# EAGLE schematic rcsdcard_v1 (EAGLE 9.6.2)
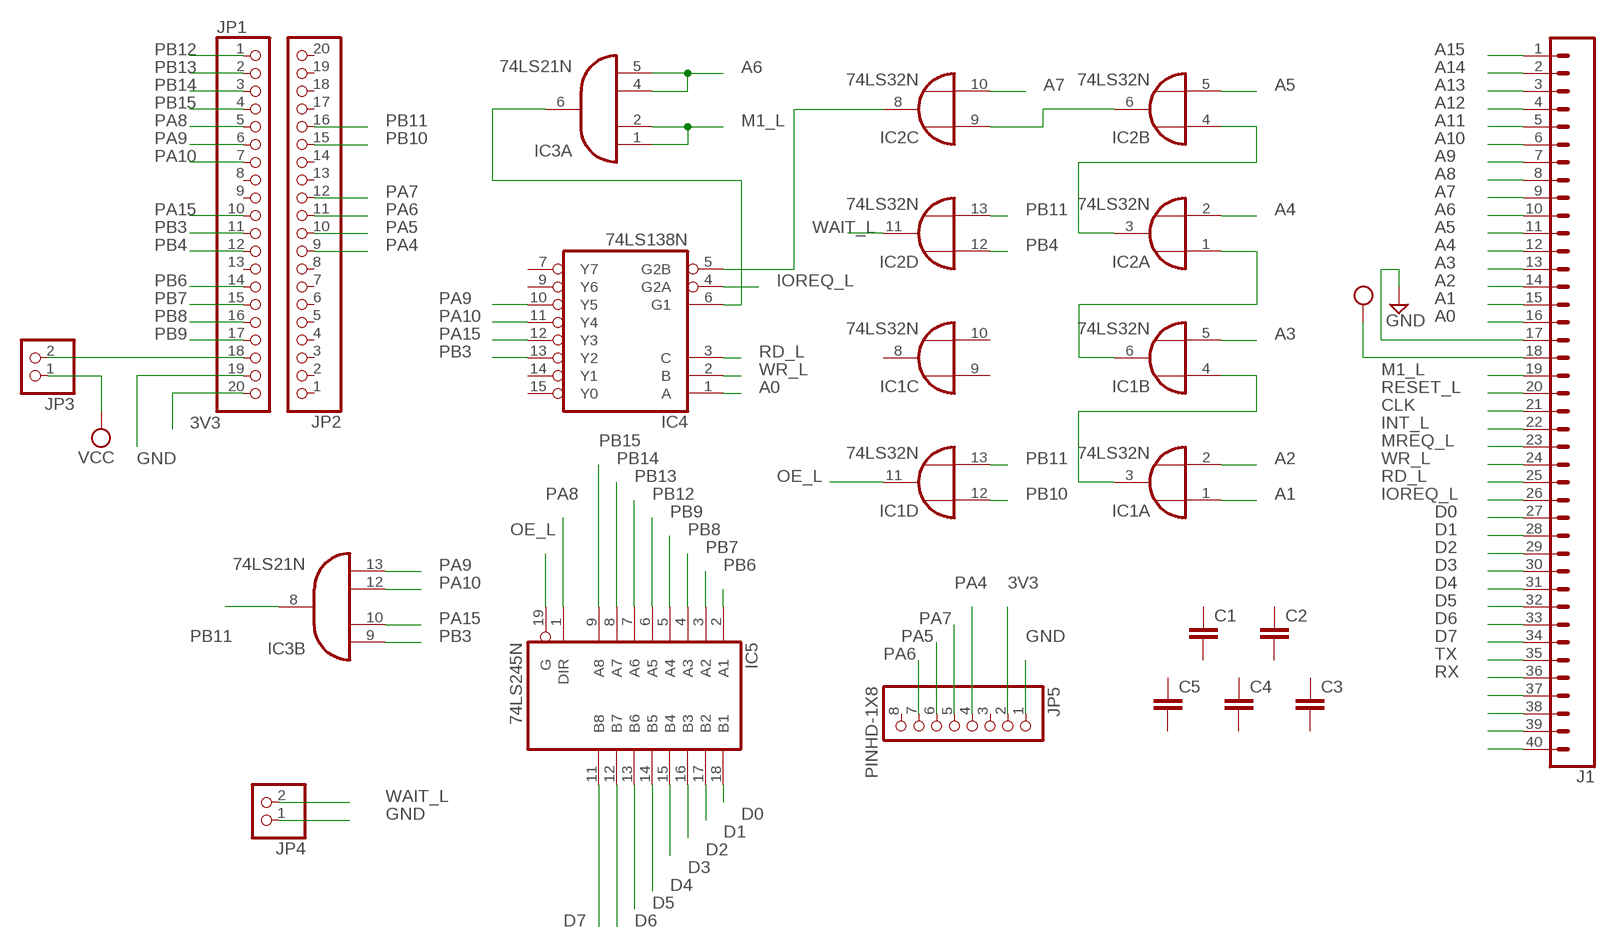
[diagram p0: schematic, sheet 1]

## Parts
C1  C-EU050-025X075  [C050-025X075]
C2  C-EU050-025X075  [C050-025X075]
C3  C-EU050-025X075  [C050-025X075]
C4  C-EU050-025X075  [C050-025X075]
C5  C-EU050-025X075  [C050-025X075]
IC1  74LS32N  [DIL14]
IC2  74LS32N  [DIL14]
IC3  74LS21N  [DIL14]
IC4  74LS138N  [DIL16]
IC5  74LS245N  [DIL20]
J1  CONN_40OFFSET  [1X40_OFFSET]
JP1  PINHD-1X20  [1X20]
JP2  PINHD-1X20  [1X20]
JP3  PINHD-1X2  [1X02]
JP4  PINHD-1X2  [1X02]
JP5  PINHD-1X8  [1X08]

## Nets
3V3: JP1.20 JP5.2
A0: IC4.1(A) J1.16
A1: IC1.1(A:I0) J1.15
A2: IC1.2(A:I1) J1.14
A3: IC1.5(B:I1) J1.13
A4: IC2.2(A:I1) J1.12
A5: IC1.6(B:O) IC2.1(A:I0) IC2.5(B:I1) J1.11
A6: IC3.4(A:I2) IC3.5(A:I3) J1.10
A7: IC2.10(C:I1) J1.9
A8: J1.8
A9: J1.7
A10: J1.6
A11: J1.5
A12: J1.4
A13: J1.3
A14: J1.2
A15: J1.1
CLK: J1.21
D0: IC5.18(B1) J1.27
D1: IC5.17(B2) J1.28
D2: IC5.16(B3) J1.29
D3: IC5.15(B4) J1.30
D4: IC5.14(B5) J1.31
D5: IC5.13(B6) J1.32
D6: IC5.12(B7) J1.33
D7: IC5.11(B8) J1.34
GND: J1.17 JP1.19 JP4.1 JP5.1
INT_L: J1.22
IOREQ_L: IC4.4(G2A) J1.26
M1_L: IC3.1(A:I0) IC3.2(A:I1) J1.19
MREQ_L: J1.23
N$1: J1.37
N$2: J1.38
N$3: J1.39
N$4: IC1.3(A:O) IC1.4(B:I0)
N$5: JP1.18 JP3.2
N$8: IC2.3(A:O) IC2.4(B:I0)
N$9: IC3.6(A:O) IC4.6(G1)
N$10: IC2.6(B:O) IC2.9(C:I0)
N$12: IC2.8(C:O) IC4.5(G2B)
N$13: J1.40
OE_L: IC1.11(D:O) IC5.19(G)
PA4: JP2.9 JP5.4
PA5: JP2.10 JP5.6
PA6: JP2.11 JP5.7
PA7: JP2.12 JP5.5
PA8: IC5.1(DIR) JP1.5
PA9: IC3.13(B:I3) IC4.10(Y5) JP1.6
PA10: IC3.12(B:I2) IC4.11(Y4) JP1.7
PA15: IC3.10(B:I1) IC4.12(Y3) JP1.10
PB3: IC3.9(B:I0) IC4.13(Y2) JP1.11
PB4: IC2.12(D:I0) JP1.12
PB6: IC5.2(A1) JP1.14
PB7: IC5.3(A2) JP1.15
PB8: IC5.4(A3) JP1.16
PB9: IC5.5(A4) JP1.17
PB10: IC1.12(D:I0) JP2.15
PB11: IC1.13(D:I1) IC2.13(D:I1) IC3.8(B:O) JP2.16
PB12: IC5.6(A5) JP1.1
PB13: IC5.7(A6) JP1.2
PB14: IC5.8(A7) JP1.3
PB15: IC5.9(A8) JP1.4
RD_L: IC4.3(C) J1.25
RESET_L: J1.20
RX: J1.36
TX: J1.35
VCC: J1.18 JP3.1
WAIT_L: IC2.11(D:O) JP4.2
WR_L: IC4.2(B) J1.24
Unconnected: C1.1 C1.2 C2.1 C2.2 C3.1 C3.2 C4.1 C4.2 C5.1 C5.2 IC1.8(C:O) IC1.9(C:I0) IC1.10(C:I1) IC4.7(Y7) IC4.9(Y6) IC4.14(Y1) IC4.15(Y0) JP1.8 JP1.9 JP1.13 JP2.1 JP2.2 JP2.3 JP2.4 JP2.5 JP2.6 JP2.7 JP2.8 JP2.13 JP2.14 JP2.17 JP2.18 JP2.19 JP2.20 JP5.3 JP5.8

## Power pins joined to a net without a drawn wire
GND: IC1.7(P:GND) IC2.7(P:GND) IC3.7(P:GND) IC4.8(GND) IC5.10(GND)
VCC: IC1.14(P:VCC) IC2.14(P:VCC) IC3.14(P:VCC) IC4.16(VCC) IC5.20(VCC)

## Library data of the parts
C1-C5 = rcl:C-EU: CAPACITOR, European symbol; SPICEPREFIX: C
IC1 IC2 = 74xx-eu:74*32: Quad 2-input OR gate
IC3 = 74xx-eu:74*21: Dual 4-input AND gate
IC4 = 74xx-eu:74*138: 3-line to 8-line DECODER/DEMULTIPLEXER
IC5 = 74xx-eu:74*245: Octal BUS TRANSCEIVER, 3-state
J1 = SparkFun-Connectors:CONN_40: Multi connection point. Often used as Generic Header-pin footprint for 0.1 inch spaced/style header connections On any of the 0.1 inch spaced packages, you can populate with these: Break Away Headers - Straight <https://www.sparkfun.com/products/116> (PRT-00116) Break Away Male Headers - Right Angle <https://www.sparkfun.com/products/553> (PRT-00553) Female Headers <https://www.sparkfun.com/products/115> (PRT-00115) Break Away Headers - Machine Pin <https://www.sparkfun.com/products/117> (PRT-00117) Break Away Female Headers - Swiss Machine Pin <https://www.sparkfun.com/products/743> (PRT-00743) For SCREWTERMINALS and SPRING TERMINALS visit here: Screw Terimnals on SparkFun.com <https://www.sparkfun.com/search/results?term=Screw+Terminals> (5mm/3.5mm/2.54mm spacing) This device is also useful as a general connection point to wire up your design to another part of your project. Our various solder wires solder well into these plated through hole pads. Hook-Up Wire - Assortment (Stranded, 22 AWG) <https://www.sparkfun.com/products/11375> (PRT-11375) Hook-Up Wire - Assortment (Solid Core, 22 AWG) <https://www.sparkfun.com/products/11367> (PRT-11367) View the entire wire category on our website here <https://www.sparkfun.com/categories/141> Special notes: Molex polarized connector foot print use with SKU : PRT-08231 with associated crimp pins and housings. 1MM SMD Version SKU: PRT-10208 NOTES ON THE VARIANTS LOCK and LOCK_LONGPADS... This footprint was designed to help hold the alignment of a through-hole component (i.e. 6-pin header) while soldering it into place. You may notice that each hole has been shifted either up or down by 0.005 of an inch from it's more standard position (which is a perfectly straight line). This slight alteration caused the pins (the squares in the middle) to touch the edges of the holes. Because they are alternating, it causes a "brace" to hold the component in place. 0.005 has proven to be the perfect amount of "off-center" position when using our standard breakaway headers. Although looks a little odd when you look at the bare footprint, once you have a header in there, the alteration is very hard to notice. Also,if you push a header all the way into place, it is covered up entirely on the bottom side.
JP1 JP2 = pinhead:PINHD-1X20: PIN HEADER
JP3 JP4 = pinhead:PINHD-1X2: PIN HEADER
JP5 = Connector:PINHD-1X8: PIN HEADER; CATEGORY: CONNECTOR; SUB-CATEGORY: PIN-HEADER